# EAGLE design MRCS-Don-Wood-IR-Detector-Circuit (EAGLE 7.7.0)
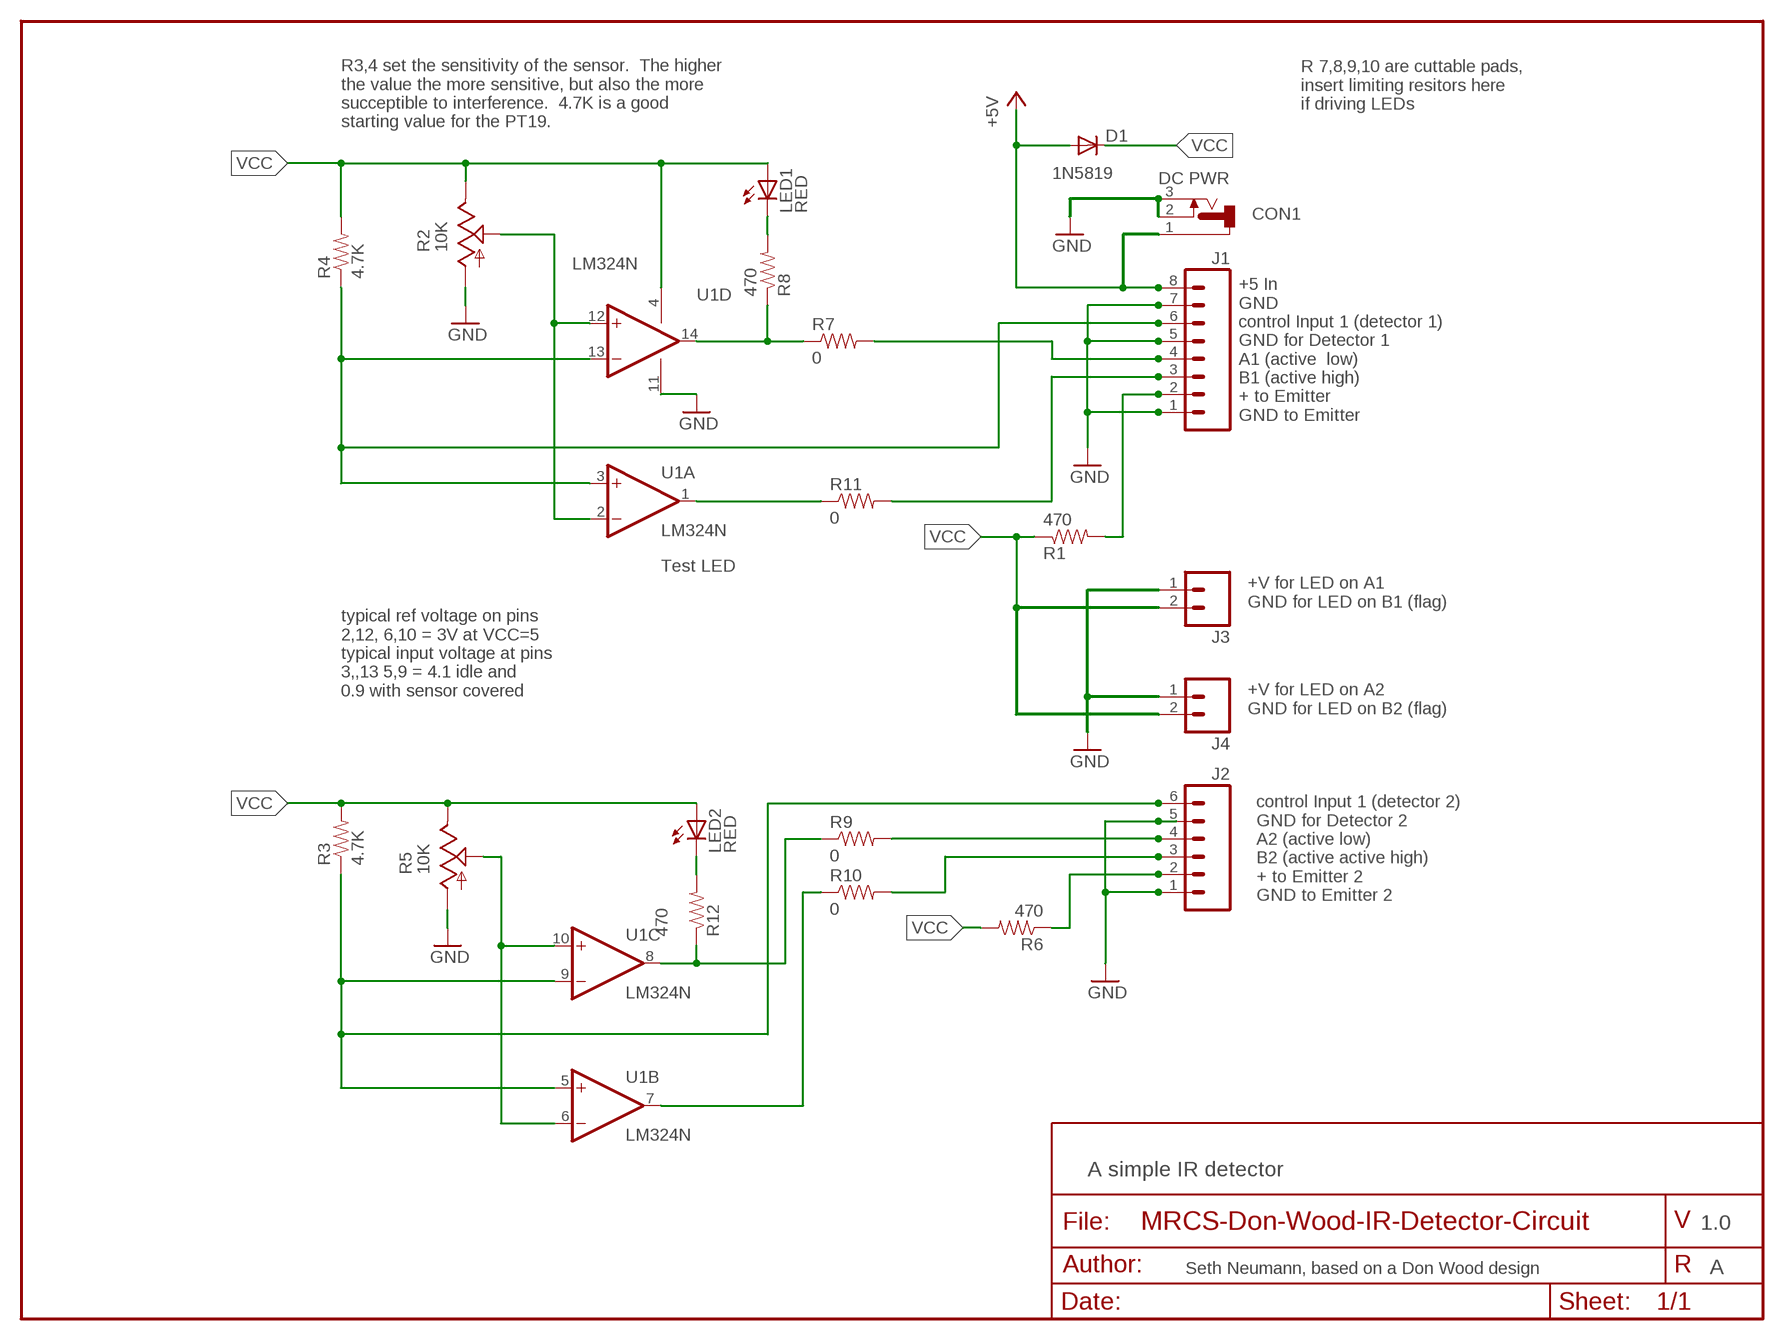
[diagram p0: schematic, sheet 1]

## Parts
CON1  DC PWR  CONNECTOR-DC-POWER-RA  [DCJ0202]
D1  1N5819  DIODEPTH  [DIODE-1N4001]
J1  CONNECTOR-M08LOCK  [1X08_LOCK]
J2  CONNECTOR-M06LOCK  [1X06_LOCK]
J3  CONNECTOR-M021X02-LOCK  [1X02_LOCK]
J4  CONNECTOR-M021X02-LOCK  [1X02_LOCK]
LED1  RED  LEDLED3MM  [LED3MM]
LED2  RED  LEDLED3MM  [LED3MM]
R1  470  RPTH04  [AXIAL-0.4-RES]
R2  10K  TRIM_US-RS3  [RS3]
R3  4.7K  RPTH04  [AXIAL-0.4-RES]
R4  4.7K  RPTH04  [AXIAL-0.4-RES]
R5  10K  TRIM_US-RS3  [RS3]
R6  470  RPTH04  [AXIAL-0.4-RES]
R7  0  RPTH-R0  [CUT-R]
R8  470  RPTH04  [AXIAL-0.4-RES]
R9  0  RPTH-R0  [CUT-R]
R10  0  RPTH-R0  [CUT-R]
R11  0  RPTH-R0  [CUT-R]
R12  470  RPTH04  [AXIAL-0.4-RES]
U1  LM324N  [DIL14]

## Nets
+5V: CON1.1 D1.A J1.8
A1: J1.4 R7.P1
A2: J2.4 R9.P1
B1: J1.3 R11.P1
B2: J2.3 R10.P1
GND: CON1.2 CON1.3 J1.1 J1.5 J1.7 J2.1 J2.5 J3.1(A) J4.1(A) R2.A R5.A U1.11(P:V-)
IN1: J1.6 R4.P$1 U1.3(A:+IN) U1.13(D:-IN)
IN2: J2.6 R3.P$1 U1.5(B:+IN) U1.9(C:-IN)
N$1: LED2.K(C) R12.P$2
N$2: J1.2 R1.P$2
N$9: R7.P2 R8.P$1 U1.14(D:OUT)
N$10: R9.P2 R12.P$1 U1.8(C:OUT)
N$11: R10.P2 U1.7(B:OUT)
N$12: J2.2 R6.P$1
N$13: R11.P2 U1.1(A:OUT)
N$16: LED1.K(C) R8.P$2
REF1: R2.S U1.2(A:-IN) U1.12(D:+IN)
REF2: R5.S U1.6(B:-IN) U1.10(C:+IN)
VCC: D1.C J3.2(B) J4.2(B) LED1.A LED2.A R1.P$1 R2.E R3.P$2 R4.P$2 R5.E R6.P$2 U1.4(P:V+)

## Notes on the sheet
- R 7,8,9,10 are cuttable pads,
  insert limiting resitors here 
  if driving LEDs
- R3,4 set the sensitivity of the sensor.  The higher
  the value the more sensitive, but also the more
  succeptible to interference.  4.7K is a good
  starting value for the PT19.
- +5 In
  GND
  control Input 1 (detector 1)
  GND for Detector 1
  A1 (active  low)
  B1 (active high)
  + to Emitter
  GND to Emitter
- Test LED
- +V for LED on A1
  GND for LED on B1 (flag)
- typical ref voltage on pins
  2,12, 6,10 = 3V at VCC=5
  typical input voltage at pins
  3,,13 5,9 = 4.1 idle and
  0.9 with sensor covered
- +V for LED on A2
  GND for LED on B2 (flag)
- control Input 1 (detector 2)
  GND for Detector 2
  A2 (active low)
  B2 (active active high)
  + to Emitter 2
  GND to Emitter 2
- A simple IR detector
- 1.0
- Seth Neumann, based on a Don Wood design | A

## Library data of the parts
CON1 = SPCoast:CONNECTOR-DC-POWER: DC POWER JACK
D1 = SPCoast:DIODE: Diode These are standard reverse protection diodes and small signal diodes. SMA package can handle up to about 1A. SOD-323 can handle about 200mA. What the SOD-323 package when ordering, there are some mfgs out there that are 5-pin packages.
J1 = SPCoast:CONNECTOR-M08: Header 8 Standard 8-pin 0.1" header. Use with straight break away headers (SKU : PRT-00116), right angle break away headers (PRT-00553), swiss pins (PRT-00743), machine pins (PRT-00117), and female headers (PRT-00115).
J2 = SPCoast:CONNECTOR-M06: Header 6 Standard 6-pin 0.1" header
J3 J4 = SPCoast:CONNECTOR-M02: PHOENIX CONNECTOR
LED1 LED2 = SPCoast:LED*
R1 R3 R4 R6-R12 = SPCoast:R*: Resistor Basic schematic elements and footprints for 0603, 1206, and PTH 1/10th watt (small) resistors.
R2 R5 = pot:TRIM_US-: POTENTIOMETER
U1 = SPCoast:LM324: OP AMP

## Board
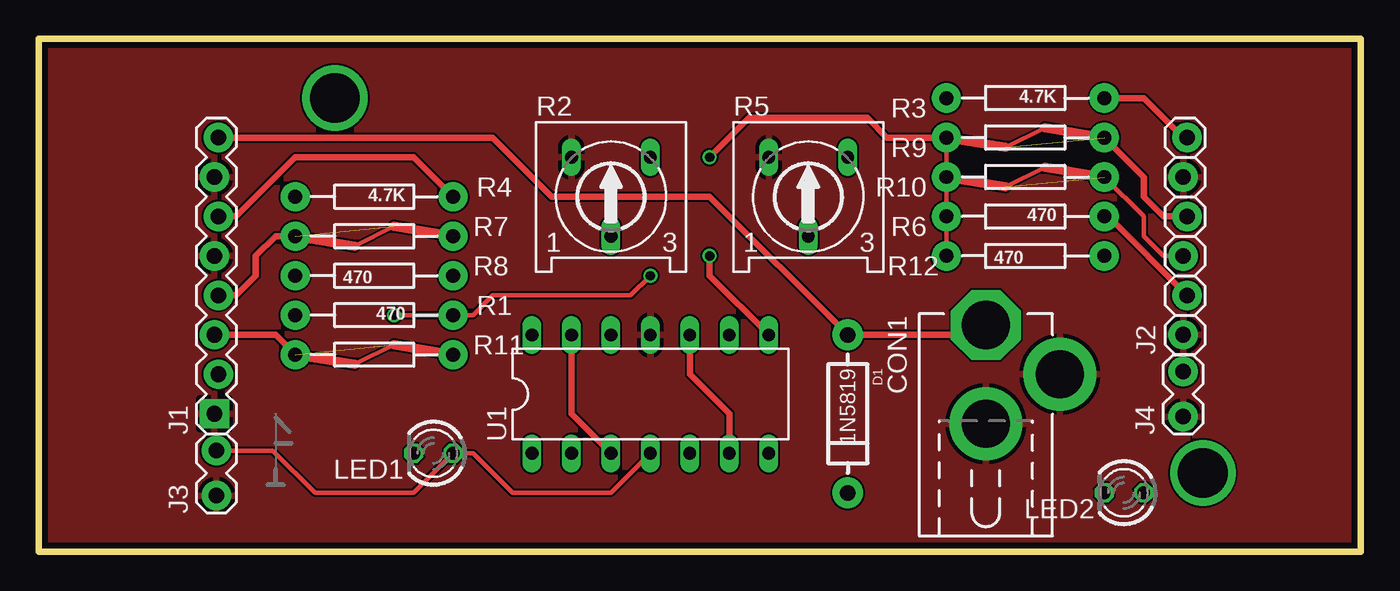
[diagram p1: board, top side]
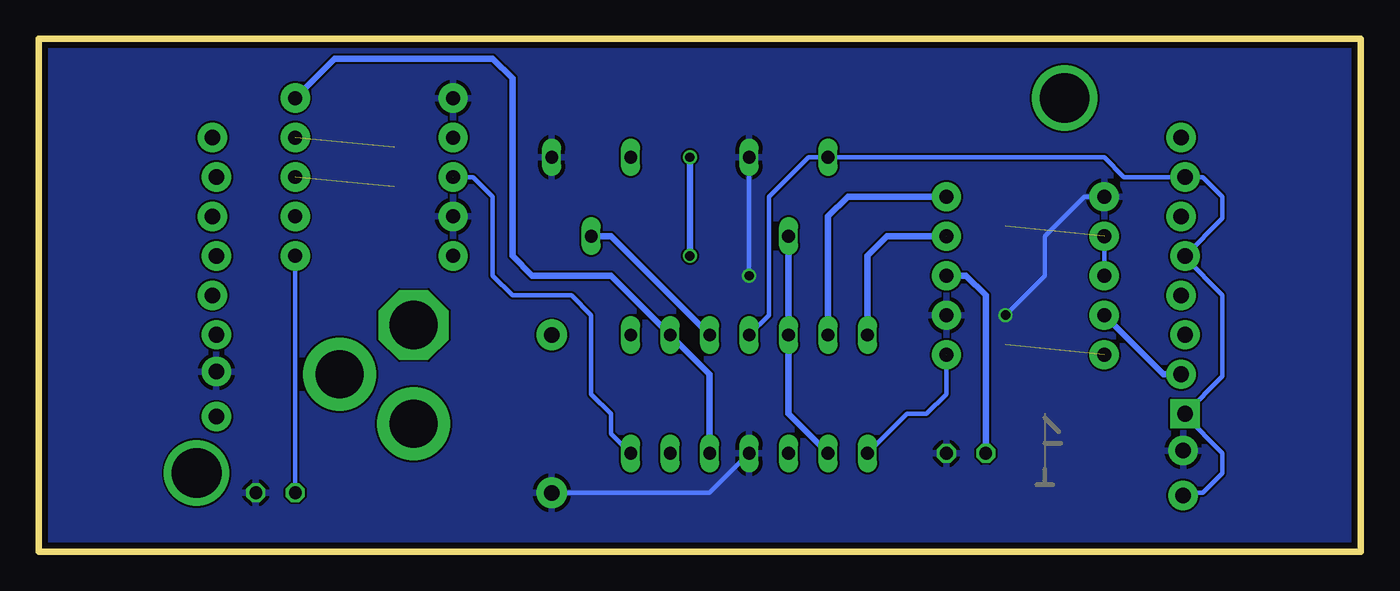
[diagram p2: board, bottom side, seen from below]

Size 85.09 x 33.02 mm. Coordinates in mm from the lower left corner, seen from the top.
Outline: 0,0 85.09,0 85.09,33.02 0,33.02 0,0
Copper layers (1*16): Top 0.035mm / dielectric 1.5mm / Bottom 0.035mm
Design rules "default *": minimum track width 5mil, minimum drill 0.2mm, track to track 5mil, track to pad 5mil, pad to pad 5mil, via to via 5mil, smd to smd 5mil, copper to edge 0.4mm, drill to drill 5mil, minimum pad ring 3mil, minimum via ring 3mil, stop-mask expansion 4mil, vias tented up to drill 0mil, thermal gap 10mil

### Footprints (pad centres in the part's own frame; a part is rotated, then mirrored left to right if it is on the bottom)
DCJ0202 = drill 3.1 pad 4.5 octagon: 1 0,3.175 | drill 3.1 pad 4.7: 2 4.763,0; 3 0,-3.175
DIODE-1N4001 = drill 1 pad 1.981: A 5.08,0; C -5.08,0
1X08_LOCK = drill 1.016 pad 1.88 square: 1 0,0.127 | drill 1.016 pad 1.88: 2 2.54,-0.127; 3 5.08,0.127; 4 7.62,-0.127; 5 10.16,0.127; 6 12.7,-0.127; 7 15.24,0.127; 8 17.78,-0.127
1X06_LOCK = drill 1.016 pad 1.88: 1 0,0; 2 2.54,-0.254; 3 5.08,0; 4 7.62,-0.254; 5 10.16,0; 6 12.7,-0.254
1X02_LOCK = drill 1.016 pad 1.88: 1 -0.178,0; 2 2.718,0
LED3MM = drill 0.813 octagon: A -1.27,0; K 1.27,0
AXIAL-0.4-RES = drill 0.9 pad 1.88: P$1 -5.08,0; P$2 5.08,0
RS3 = drill 0.813 long: A -2.54,2.54; E 2.54,2.54; S 0,-2.54
CUT-R = drill 0.9 pad 1.88: P1 5.08,0; P2 -5.08,0
DIL14 = drill 0.813 long: 1 -7.62,-3.81; 2 -5.08,-3.81; 3 -2.54,-3.81; 4 0,-3.81; 5 2.54,-3.81; 6 5.08,-3.81; 7 7.62,-3.81; 8 7.62,3.81; 9 5.08,3.81; 10 2.54,3.81; 11 0,3.81; 12 -2.54,3.81; 13 -5.08,3.81; 14 -7.62,3.81

### Placement (x,y rotation side)
CON1  60.96,11.43 0 top
D1  52.07,8.89 90 top
J1  11.43,8.89 90 top
J2  73.66,13.97 90 top
J3  11.43,3.81 90 top
J4  73.66,8.89 90 top
LED1  25.4,6.35 180 top
LED2  69.85,3.81 180 top
R1  21.59,15.24 180 top
R2  36.83,22.86 0 top
R3  63.5,29.21 180 top
R4  21.59,22.86 180 top
R5  49.53,22.86 0 top
R6  63.5,21.59 180 top
R7  21.59,20.32 0 top
R8  21.59,17.78 0 top
R9  63.5,26.67 180 top
R10  63.5,24.13 180 top
R11  21.59,12.7 0 top
R12  63.5,19.05 0 top
U1  39.37,10.16 0 top
U$1  [MRCSLOGOBTM]  13.97,3.81 0 top
U$2  [MRCSLOGOTOP]  13.97,3.81 0 top
U$3  [CA-PROP65WARNING]  41.91,10.16 0 top

### Tracks (layer width: path | path; a pad name or v marks a point on that pad's centre or on a via)
+5V
  Top 0.406: CON1.1 60.33,13.97 D1.A 43.18,22.86 33.02,22.86 29.21,26.67 J1.8
A1  (1 unrouted)
  Top 0.406: J1.4 12.7,16.51 13.97,17.78 13.97,19.05 15.24,20.32 16.51,20.32
A2  (1 unrouted)
  Top 0.406: J2.4 72.39,21.59 71.12,22.86 71.12,24.13 68.58,26.67
B1  (1 unrouted)
  Top 0.406: J1.3 15.24,13.97 16.51,12.7
B2  (1 unrouted)
  Top 0.305: J2.3 72.39,19.05 71.12,20.32 71.12,21.59 68.58,24.13
GND
  Bottom 0.305: J3.1 11.25,3.81 10.16,3.81 8.89,5.08 8.89,6.35 11.3,8.76 J1.1 8.89,11.3 8.89,16.51 11.3,18.92 J1.5 8.89,21.46 8.89,22.86 10.16,24.13 J1.7 15.24,24.13 16.51,25.4 R2.A 35.56,25.4 38.1,22.86 38.1,15.24 U1.11
  pour Top: 0,0 85.09,0 85.09,33.02 0,33.02
IN1
  Top 0.406: U1.13 34.29,8.89 U1.3 | J1.6 12.7,21.59 16.51,25.4 24.13,25.4 R4.P$1
  Bottom 0.406: R4.P$1 33.02,22.86 34.29,21.59 U1.13
IN2
  Top 0.406: J2.6 73.66,26.67 71.12,29.21 R3.P$1
  Bottom 0.406: U1.5 41.91,11.43 U1.9 48.26,17.78 53.34,17.78 54.61,19.05 54.61,30.48 55.88,31.75 66.04,31.75 R3.P$1
N$1
  Bottom 0.305: R12.P$2 LED2.K
N$2
  Bottom 0.406: J1.2 12.7,11.43 R1.P$2
N$3  (via drill 3.2)
  other vias: 19.05,29.21
N$4  (via drill 3.2)
  other vias: 74.93,5.08
N$9  (1 unrouted)
  Bottom 0.305: R7.P2 R8.P$1
  Bottom 0.406: 26.67,20.32 30.48,20.32 31.75,19.05 U1.14
N$10  (via drill 0.6)
  Top 0.305: 58.42,26.67 R12.P$1
  Top 0.406: 58.42,26.67 54.61,26.67 53.34,27.94 45.72,27.94 v43.18,25.4 | v43.18,19.05 43.18,17.78 U1.8
  Bottom 0.406: v43.18,25.4 v43.18,19.05
N$11  (1 unrouted)
  Bottom 0.305: 58.42,24.13 57.15,24.13 55.88,22.86 55.88,17.78 54.61,16.51 50.8,16.51 49.53,15.24 49.53,10.16 48.26,8.89 48.26,7.62 U1.7
N$12
  Top 0.406: R6.P$1 68.83,21.59 J2.2
N$13  (1 unrouted)
  Bottom 0.305: 26.67,12.7 26.67,10.16 27.94,8.89 29.21,8.89 U1.1
N$16
  Bottom 0.406: R8.P$2 25.4,17.78 24.13,16.51 LED1.K
REF1
  Bottom 0.406: R2.S U1.12 36.83,8.89 U1.2
REF2
  Top 0.406: U1.10 41.91,11.43 44.45,8.89 U1.6
  Bottom 0.406: R5.S 48.26,20.32 U1.10
VCC  (via drill 0.6)
  Top 0.305: J3.2 15.06,6.53 17.78,3.81 24.13,3.81 LED1.A 27.94,6.35 30.48,3.81 36.83,3.81 U1.4 | v22.86,15.24 R1.P$1 27.94,15.24 29.21,16.51 38.1,16.51 v39.37,17.78
  Bottom 0.305: D1.C 41.91,3.81 U1.4 | R4.P$2 17.78,22.86 20.32,20.32 20.32,17.78 v22.86,15.24 | v39.37,17.78 R2.E
  pour Bottom: 0,0 85.09,0 85.09,33.02 0,33.02

### Text on the board
Document: Use tPlace/bPlace for silkscreen text and drawings / Use Document, tDocu and bDocu for assembly notes and documentation that does NOT go on the board
tDocu: Ckt 1 | Ckt 2 | IN2 / GND / A2 / B2 / EM+ / EM- / +5 / GND | +5 / GND / In 1 / GND / A1 / B1 / EM + / EM - / +5 / GND | Ckt 1 | Ckt 2
bDocu: Optical Detector after Don Wood / Seth Neumann 20201123